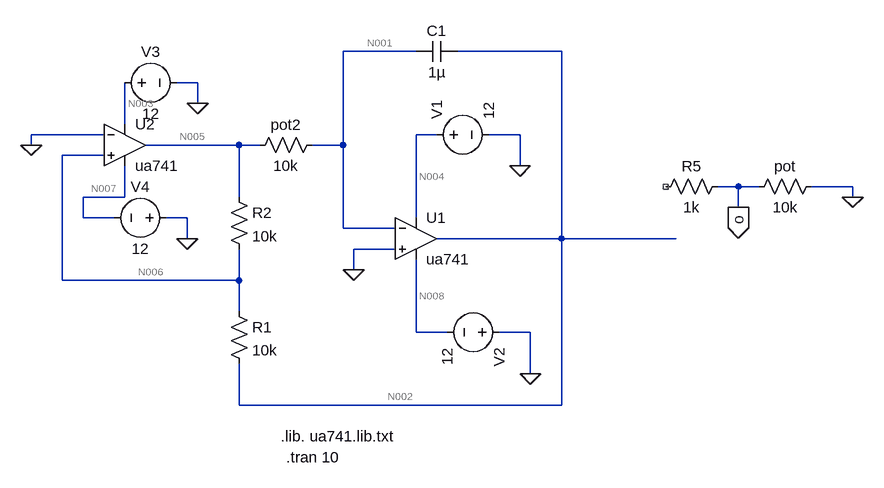
[diagram p0: schematic Triangular.asc]
Triangular.asc, the LTspice schematic file:
Version 4
SHEET 1 1188 680
WIRE 224 -128 112 -128
WIRE 448 -128 288 -128
WIRE -112 -80 -144 -80
WIRE -112 -48 -112 -80
WIRE -224 -16 -224 -80
WIRE -256 0 -368 0
WIRE 256 0 224 0
WIRE 384 0 336 0
WIRE -368 16 -368 0
WIRE -48 16 -192 16
WIRE -16 16 -48 16
WIRE 112 16 112 -128
WIRE 112 16 64 16
WIRE -256 32 -320 32
WIRE 384 48 384 0
WIRE 720 80 688 80
WIRE 752 80 720 80
WIRE 896 80 832 80
WIRE -224 96 -224 48
WIRE -224 96 -288 96
WIRE -48 96 -48 16
WIRE 896 96 896 80
WIRE 720 112 720 80
WIRE -288 128 -288 96
WIRE -240 128 -288 128
WIRE -128 128 -160 128
WIRE 224 128 224 0
WIRE 112 144 112 16
WIRE 192 144 112 144
WIRE -128 160 -128 128
WIRE 448 160 448 -128
WIRE 448 160 256 160
WIRE 624 160 448 160
WIRE 192 176 128 176
WIRE 128 208 128 176
WIRE -320 224 -320 32
WIRE -48 224 -48 176
WIRE -48 224 -320 224
WIRE -48 272 -48 224
WIRE 224 304 224 192
WIRE 272 304 224 304
WIRE 400 304 352 304
WIRE 400 368 400 304
WIRE -48 416 -48 352
WIRE 448 416 448 160
WIRE 448 416 -48 416
FLAG 896 96 0
FLAG 720 112 o
IOPIN 720 112 Out
FLAG 384 48 0
FLAG 400 368 0
FLAG 128 208 0
FLAG -112 -48 0
FLAG -128 160 0
FLAG -368 16 0
SYMBOL voltage 240 0 R270
WINDOW 123 0 0 Left 0
WINDOW 39 0 0 Left 0
SYMATTR InstName V1
SYMATTR Value 12
SYMBOL voltage 368 304 R90
WINDOW 123 0 0 Left 0
WINDOW 39 0 0 Left 0
SYMATTR InstName V2
SYMATTR Value 12
SYMBOL OpAmps\\ua741 224 96 R0
SYMATTR InstName U1
SYMBOL res 848 64 R90
WINDOW 0 0 56 VBottom 2
WINDOW 3 32 56 VTop 2
SYMATTR InstName pot
SYMATTR Value 10k
SYMBOL res 592 96 R270
WINDOW 0 32 56 VTop 2
WINDOW 3 0 56 VBottom 2
SYMATTR InstName R5
SYMATTR Value 1k
SYMBOL cap 288 -144 R90
WINDOW 0 0 32 VBottom 2
WINDOW 3 32 32 VTop 2
SYMATTR InstName C1
SYMATTR Value 1µ
SYMBOL res -64 256 R0
SYMATTR InstName R1
SYMATTR Value 10k
SYMBOL res -64 80 R0
SYMATTR InstName R2
SYMATTR Value 10k
SYMBOL res 80 0 R90
WINDOW 0 0 56 VBottom 2
WINDOW 3 32 56 VTop 2
SYMATTR InstName pot2
SYMATTR Value 10k
SYMBOL OpAmps\\ua741 -224 -48 R0
SYMATTR InstName U2
SYMBOL voltage -240 -80 R270
WINDOW 0 32 56 VTop 2
WINDOW 3 -32 56 VBottom 2
SYMATTR InstName V3
SYMATTR Value 12
SYMBOL voltage -144 128 R90
WINDOW 0 -32 56 VBottom 2
WINDOW 3 32 56 VTop 2
SYMATTR InstName V4
SYMATTR Value 12
TEXT 24 496 Left 2 !.tran 10
TEXT 16 464 Left 2 !.lib. ua741.lib.txt

The netlist it stands for:
* Triangular.asc
V1 N004 0 12
V2 0 N008 12
XU1 0 N001 N004 N008 N002 ua741  ; pins In+ In- V+ V- OUT
R§pot 0 o 10k
R5 NC_01 o 1k
C1 N002 N001 1µ
R1 N006 N002 10k
R2 N005 N006 10k
R§pot2 N001 N005 10k
XU2 N006 0 N003 N007 N005 ua741  ; pins In+ In- V+ V- OUT
V3 N003 0 12
V4 0 N007 12
.tran 10
.lib. ua741.lib.txt
.backanno
.end

* Results of the author's LTspice run, read from the files saved beside the schematic
* Operating Point, zero values left out:
*   V(n004) = 12 V
*   V(n008) = -12 V
*   V(n002) = -58.14 µV
*   V(n001) = 19.25 µV
*   V(n006) = -19.25 µV
*   V(n005) = 816.9 µV
*   V(n007) = -12 V
*   V(n003) = 12 V
*   I(Pot2) = -79.76 nA
*   I(R2) = 83.61 nA
*   I(R1) = 3.889 nA
*   I(V4) = -1.337 mA
*   I(V3) = -1.337 mA
*   I(V2) = -1.337 mA
*   I(V1) = -1.337 mA
*   Ix(u1:1) = 79.73 nA
*   Ix(u1:2) = 79.76 nA
*   Ix(u1:3) = 1.337 mA
*   Ix(u1:4) = -1.337 mA
*   Ix(u1:5) = 3.889 nA
*   Ix(u2:1) = 79.73 nA
*   Ix(u2:2) = 79.76 nA
*   Ix(u2:3) = 1.337 mA
*   Ix(u2:4) = -1.337 mA
*   Ix(u2:5) = -163.4 nA
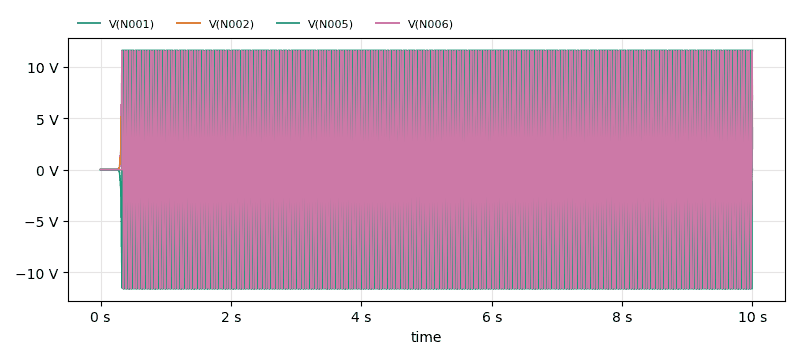
[diagram p1: Transient Analysis of Triangular.asc, plotted from the saved traces]
* Transient Analysis, 1 run:
*   V(N001): min -11.7 mV, max 11.17 mV, average 17.27 µV, rms 613.2 µV, last 198.7 µV
*   V(N002): min -11.56 V, max 11.56 V, average 18.36 mV, rms 9.658 V, last 1.044 V
*   V(N005): min -11.61 V, max 11.61 V, average -628.4 µV, rms 11.41 V, last 11.61 V
*   V(N006): min -11.58 V, max 11.58 V, average 8.453 mV, rms 7.476 V, last 6.328 V